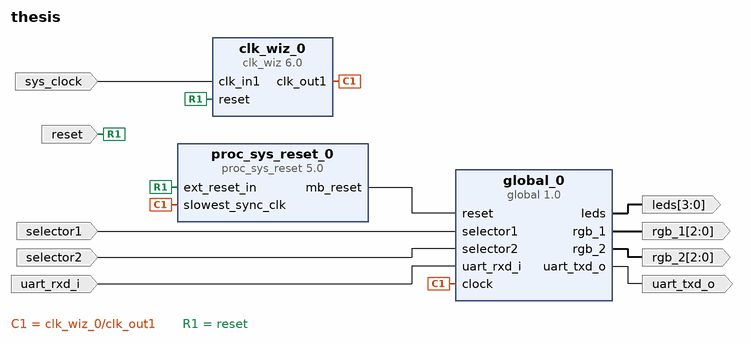
[diagram p0: block diagram of the top level]
# Vivado block design thesis, xc7z020clg400-1, Vivado 2024.1.1
create_bd_design thesis

create_bd_port -dir I -type rst reset
set_property -dict {CONFIG.POLARITY ACTIVE_HIGH} [get_bd_ports reset]
create_bd_port -dir I selector1
create_bd_port -dir I selector2
create_bd_port -dir I uart_rxd_i
create_bd_port -dir O uart_txd_o
create_bd_port -dir O -from 3 -to 0 leds
create_bd_port -dir O -from 2 -to 0 rgb_1
create_bd_port -dir O -from 2 -to 0 rgb_2
create_bd_port -dir I -type clk sys_clock
set_property -dict {CONFIG.FREQ_HZ 125000000 CONFIG.PHASE 0.0} [get_bd_ports sys_clock]

create_bd_cell -type ip -vlnv xilinx.com:user:global:1.0 global_0
create_bd_cell -type ip -vlnv xilinx.com:ip:clk_wiz:6.0 clk_wiz_0
set_property -dict {CONFIG.CLK_IN1_BOARD_INTERFACE sys_clock CONFIG.USE_BOARD_FLOW true} [get_bd_cells clk_wiz_0]
create_bd_cell -type ip -vlnv xilinx.com:ip:proc_sys_reset:5.0 proc_sys_reset_0

# ---- connections ----

connect_bd_net [get_bd_pins global_0/leds] [get_bd_ports leds]
connect_bd_net [get_bd_pins global_0/rgb_1] [get_bd_ports rgb_1]
connect_bd_net [get_bd_pins global_0/rgb_2] [get_bd_ports rgb_2]
connect_bd_net [get_bd_pins global_0/uart_txd_o] [get_bd_ports uart_txd_o]
connect_bd_net -net microblaze_0_Clk [get_bd_pins clk_wiz_0/clk_out1] [get_bd_pins global_0/clock] [get_bd_pins proc_sys_reset_0/slowest_sync_clk]
connect_bd_net [get_bd_pins proc_sys_reset_0/mb_reset] [get_bd_pins global_0/reset]
connect_bd_net [get_bd_ports reset] [get_bd_pins clk_wiz_0/reset] [get_bd_pins proc_sys_reset_0/ext_reset_in]
connect_bd_net -net selector1_1 [get_bd_ports selector1] [get_bd_pins global_0/selector1]
connect_bd_net -net selector2_1 [get_bd_ports selector2] [get_bd_pins global_0/selector2]
connect_bd_net [get_bd_ports sys_clock] [get_bd_pins clk_wiz_0/clk_in1]
connect_bd_net [get_bd_ports uart_rxd_i] [get_bd_pins global_0/uart_rxd_i]

validate_bd_design
save_bd_design
